# Altium project 16515-SBC_TO_MC2_PCA.PrjPcb (part 1 of 2)
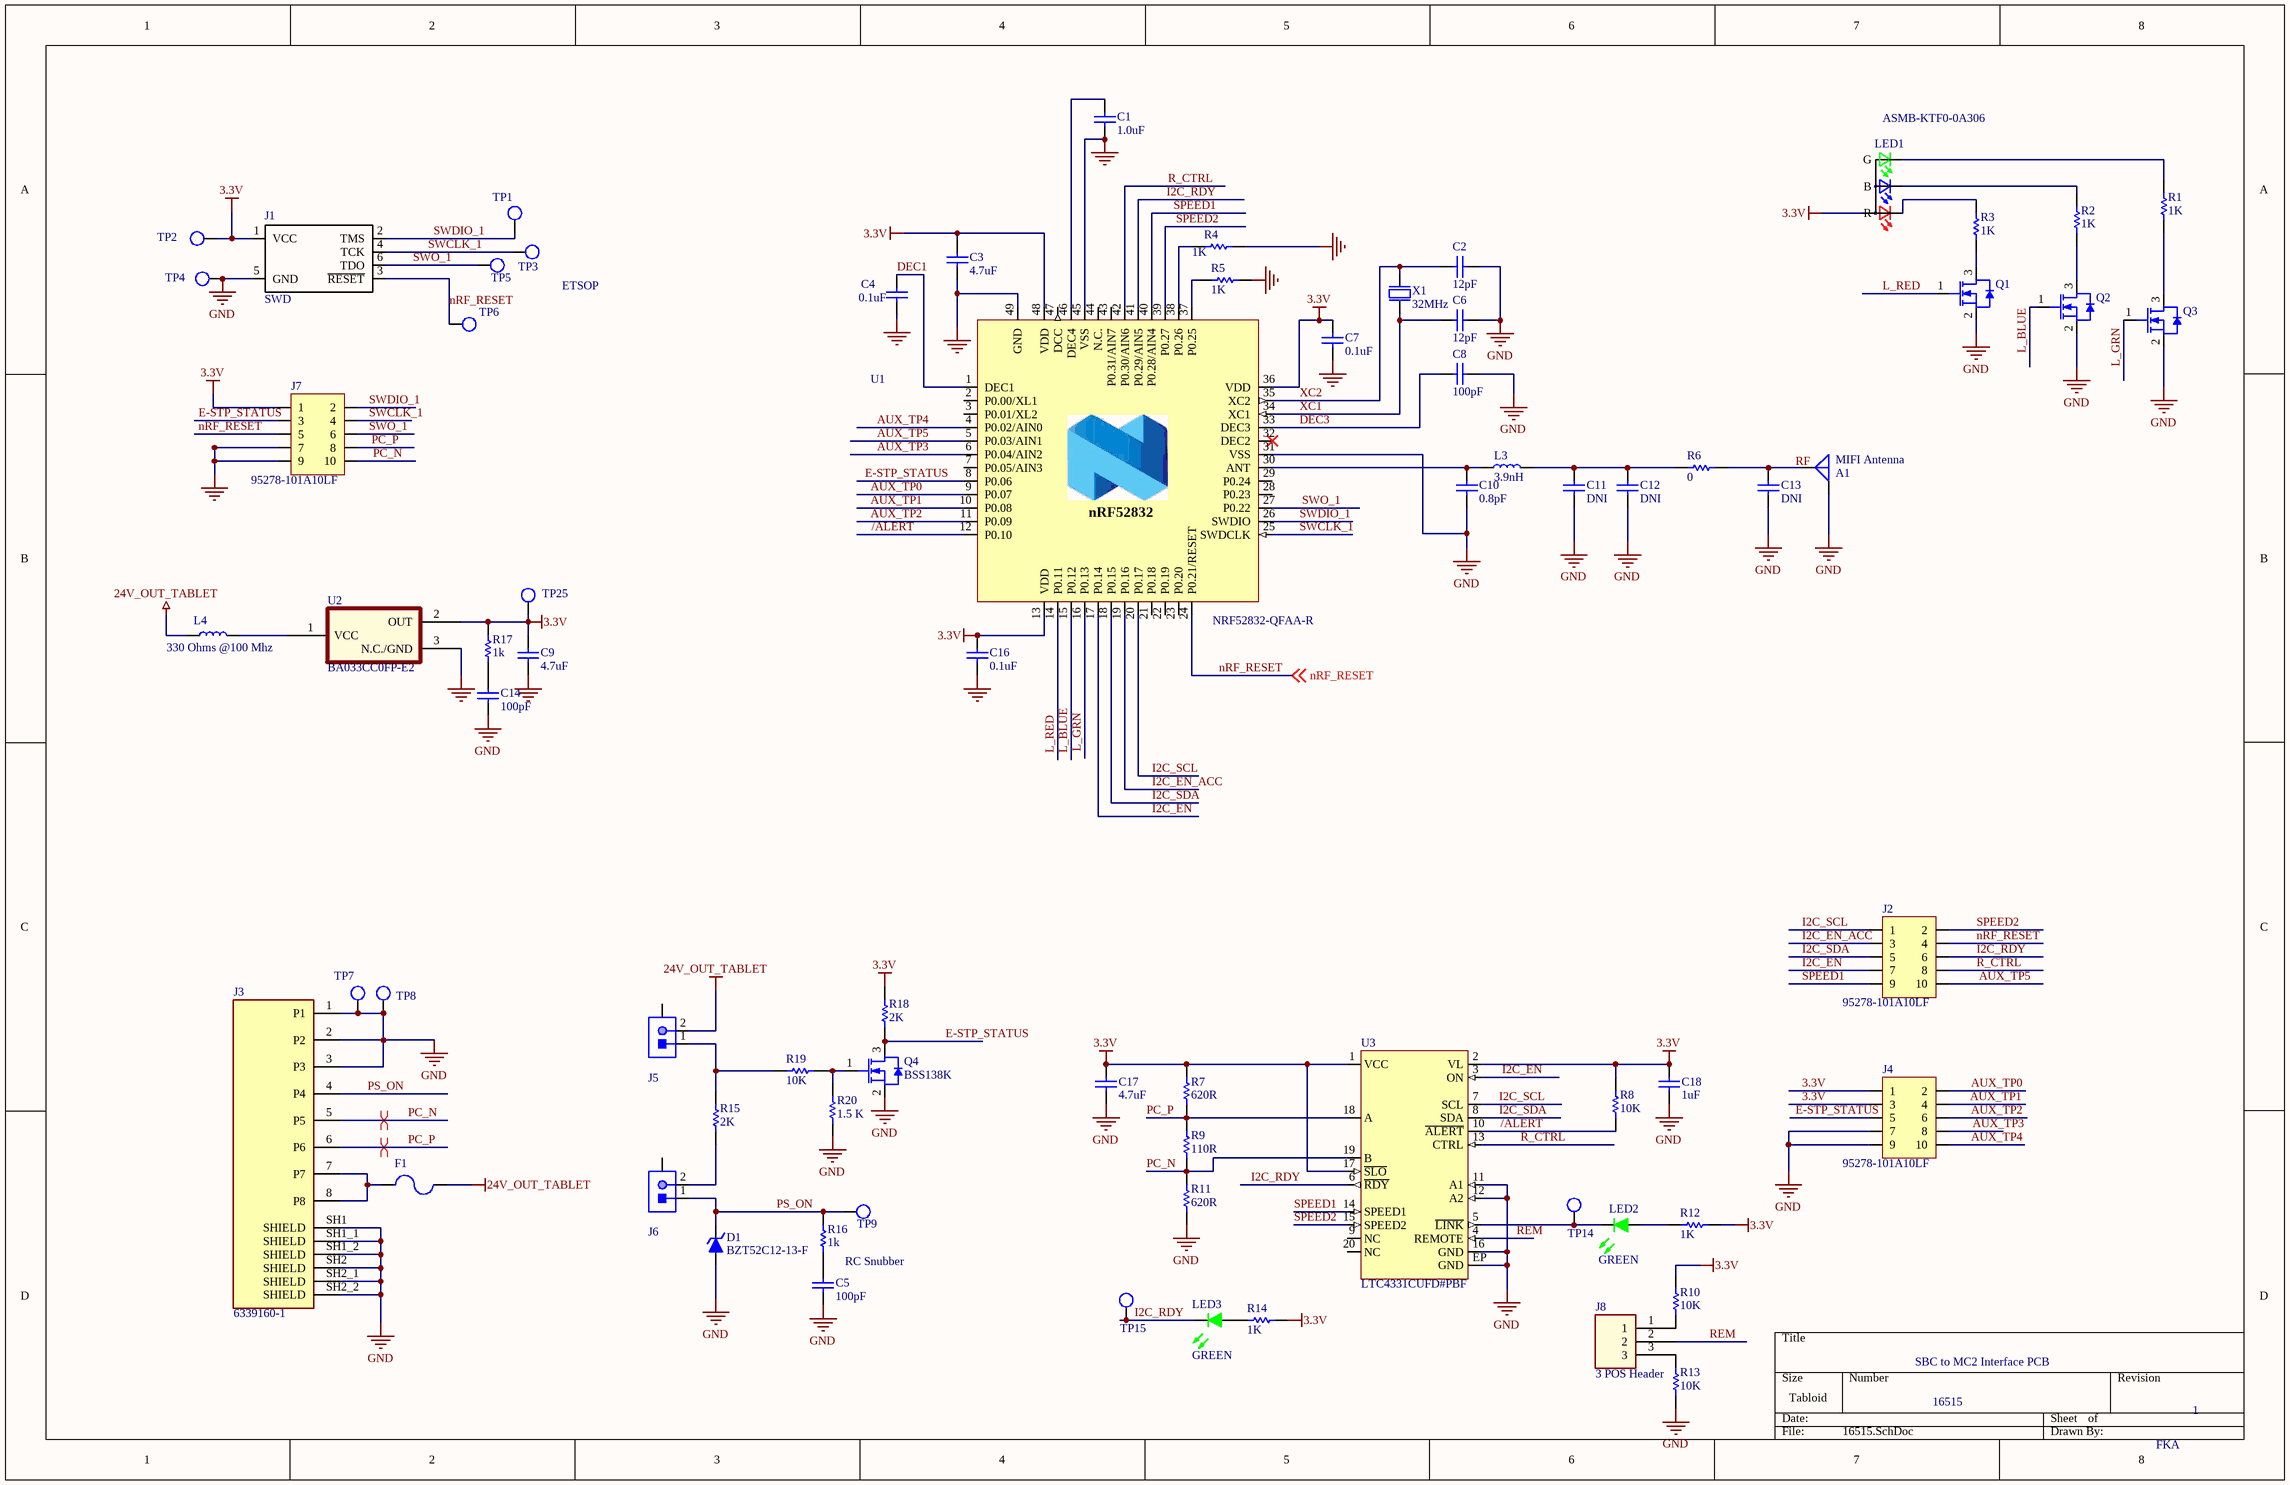
[diagram p0: 16515.SchDoc]
1 sheet, 73 parts. Net scope: global (net labels, ports and power ports of the same name join across sheets).
Board file: 16515.PcbDoc

## Sheet 16515.SchDoc: SBC to MC2 Interface PCB
size Tabloid; DrawnBy: FKA; DocumentNumber: 16515; Revision: 1; SheetNumber: 1; SheetTotal: 1

### Parts
A1  MIFI Antenna  [BLE Antenna]  (no BOM)
C1  1.0uF  [CAPC0603X10N]
C2  12pF  [CAPC0402X06N]
C3  4.7uF  [CAPC0603X10N]
C4  0.1uF  [CAPC0402X06N]
C5  100pF  [CAPC0603X10N]
C6  12pF  [CAPC0402X06N]
C7  0.1uF  [CAPC0402X06N]
C8  100pF  [CAPC0402X06N]
C9  4.7uF  [CAPC0603X10N]
C10  0.8pF  [CAPC0402X06N]
C11  DNI  [CAPC0402X06N]  (no BOM)
C12  DNI  [CAPC0402X06N]  (no BOM)
C13  DNI  [CAPC0402X06N]  (no BOM)
C14  100pF  [CAPC0603X10N]
C16  0.1uF  [CAPC0402X06N]
C17  4.7uF  [CAPC0402X06N]
C18  1uF  [CAPC0402X06N]
D1  BZT52C12-13-F  [SOD-123/Mini-SMA]
F1  Fuse  [FUSE2920]  (value not drawn)
J1  SWD  [TC2030-IDC-NL]  (no BOM)
J2  95278-101A10LF  [Amphenol_95278-101A10LF_0]
J3  6339160-1  [TE_6339160-1]
J4  95278-101A10LF  [Amphenol_95278-101A10LF_0]
J5  SM02B-PASS-TBT(LF)(SN)  [SM02B-PASS-TBT(LF)(SN)]  (value not drawn)
J6  SM02B-PASS-TBT(LF)(SN)  [SM02B-PASS-TBT(LF)(SN)]  (value not drawn)
J7  95278-101A10LF  [Amphenol_95278-101A10LF_0]
J8  3 POS Header  [3_POS_Header]
L3  3.9nH  [INDC0402X04N]
L4  330 Ohms @100 Mhz  [INDC0603X10N]
LED1  ASMB-KTF0-0A306  [ASMB-KTF0-0A306]
LED2  GREEN  [0603]
LED3  GREEN  [0603]
Q1  2SK3018T106  [SOT23]  (value not drawn)
Q2  2SK3018T106  [SOT23]  (value not drawn)
Q3  2SK3018T106  [SOT23]  (value not drawn)
Q4  BSS138K  [SOT-23-3]
R1  1K  [RESC0402X04N]
R2  1K  [RESC0402X04N]
R3  1K  [RESC0402X04N]
R4  1K  [RESC0402X04N]
R5  1K  [RESC0402X04N]
R6  0  [RESC0402X04N]
R7  620R  [RESC0402X04N]
R8  10K  [RESC0603X06N]
R9  110R  [RESC0402X04N]
R10  10K  [RESC0603X06N]
R11  620R  [RESC0402X04N]
R12  1K  [RESC0402X04N]
R13  10K  [RESC0603X06N]
R14  1K  [RESC0402X04N]
R15  2K  [RESC1206X09N]
R16  1k  [RESC0805X06N]
R17  1k  [RESC0805X06N]
R18  2K  [RESC1206X09N]
R19  10K  [RESC1206X09N]
R20  1.5 K  [RESC1206X09N]
TP1  (no value)  [Test Point]  (no BOM)
TP2  (no value)  [Test Point]  (no BOM)
TP3  (no value)  [Test Point]  (no BOM)
TP4  (no value)  [Test Point]  (no BOM)
TP5  (no value)  [Test Point]  (no BOM)
TP6  (no value)  [Test Point]  (no BOM)
TP7  (no value)  [Test Point]  (no BOM)
TP8  (no value)  [Test Point]  (no BOM)
TP9  (no value)  [Test Point]  (no BOM)
TP14  (no value)  [Test Point]  (no BOM)
TP15  (no value)  [Test Point]  (no BOM)
TP25  (no value)  [Test Point]  (no BOM)
U1  NRF52832-QFAA-R  [QFN40P600X600X90-48N]
U2  BA033CC0FP-E2  [TO252-3_BA033CC0FP-E2]
U3  LTC4331CUFD#PBF  [20-WFQFN]
X1  32MHz  [BT-XTAL_2016]

### Nets
3.3V: C3.1 C7.1 C9.2 C16.1 C17.2 C18.2 J1.1(VCC) J4.1 J4.3 J7.1 LED1.1(A) R7.2 R8.2 R10.1 R12.1 R14.1 R17.2 R18.1 TP2.1 TP25.1 U1.13(VDD) U1.36(VDD) U1.48(VDD) U2.2(OUT) U3.1(VCC) U3.2(VL) U3.17(~{SLO})
24V_OUT_TABLET: F1.2 J5.2 L4.1
GND: A1.GND(G) C1.1 C2.2 C3.2 C4.2 C5.2 C6.2 C7.2 C8.2 C9.1 C10.1 C11.2 C12.2 C13.2 C14.2 C16.2 C17.1 C18.1 D1.1(A) J1.5(GND) J3.1(P1) J3.2(P2) J3.3(P3) J3.SH1(SHIELD) J3.SH1_1(SHIELD) J3.SH1_2(SHIELD) J3.SH2(SHIELD) J3.SH2_1(SHIELD) J3.SH2_2(SHIELD) J4.7 J4.9 J7.7 J7.9 Q1.2(S) Q2.2(S) Q3.2(S) Q4.2(S) R4.2 R5.2 R11.1 R13.1 R20.2 TP4.1 TP7.1 TP8.1 U1.31(VSS) U1.45(VSS) U1.49(GND) U2.3(N.C./GND) U3.11(A1) U3.12(A2) U3.16(GND) U3.EP(GND) X1.2(GND) X1.4(GND)
/ALERT: R8.1 U1.12(P0.10) U3.10(~{ALERT})
AUX_TP0: J4.2 U1.9(P0.07)
AUX_TP1: J4.4 U1.10(P0.08)
AUX_TP2: J4.6 U1.11(P0.09)
AUX_TP3: J4.8 U1.6(P0.04/AIN2)
AUX_TP4: J4.10 U1.4(P0.02/AIN0)
AUX_TP5: J2.10 U1.5(P0.03/AIN1)
DEC1: C4.1 U1.1(DEC1)
DEC3: C8.1 U1.33(DEC3)
E-STP_STATUS: J4.5 J7.3 Q4.3(D) R18.2 U1.8(P0.06)
I2C_EN: J2.7 U1.17(P0.14) U3.3(ON)
I2C_EN_ACC: J2.3 U1.19(P0.16)
I2C_RDY: J2.6 LED3.2(K) TP15.1 U1.41(P0.29/AIN5) U3.6(~{RDY})
I2C_SCL: J2.1 U1.20(P0.17) U3.7(SCL)
I2C_SDA: J2.5 U1.18(P0.15) U3.8(SDA)
L_BLUE: Q2.1(G) U1.15(P0.12)
L_GRN: Q3.1(G) U1.16(P0.13)
L_RED: Q1.1(G) U1.14(P0.11)
nRF_RESET: J1.3(~{RESET}) J2.4 J7.5 TP6.1 U1.24(P0.21/RESET) ; off-sheet nRF_RESET
PC_N: J3.5(P5) J7.10 R9.1 R11.2 U3.19(B)
PC_P: J3.6(P6) J7.8 R7.1 R9.2 U3.18(A)
PS_ON: D1.2(K) J3.4(P4) J6.1 R16.2 TP9.1
R_CTRL: J2.8 U1.42(P0.30/AIN6) U3.13(CTRL)
REM: J8.2 U3.4(REMOTE)
SPEED1: J2.9 U1.40(P0.28/AIN4) U3.14(SPEED1)
SPEED2: J2.2 U1.39(P0.27) U3.15(SPEED2)
SWCLK_1: J1.4(TCK) J7.4 TP3.1 U1.25(SWDCLK)
SWDIO_1: J1.2(TMS) J7.2 TP1.1 U1.26(SWDIO)
SWO_1: J1.6(TDO) J7.6 TP5.1 U1.27(P0.22)
XC1: C6.1 U1.34(XC1) X1.1(inp)
XC2: C2.1 U1.35(XC2) X1.3(out)
NetA1_ANT: A1.ANT(S) C13.1 R6.2
NetC1_2: C1.2 U1.46(DEC4)
NetC5_1: C5.1 R16.1
NetC10_2: C10.2 L3.1 U1.30(ANT)
NetC11_1: C11.1 C12.1 L3.2 R6.1
NetC14_1: C14.1 R17.1
NetF1_1: F1.1 J3.7(P7) J3.8(P8)
NetJ5_1: J5.1 R15.2 R19.2
NetJ6_2: J6.2 R15.1
NetJ8_1: J8.1 R10.2
NetJ8_3: J8.3 R13.2
NetL4_2: L4.2 U2.1(VCC)
NetLED1_2: LED1.2(R) R3.2
NetLED1_3: LED1.3(G) R1.2
NetLED1_4: LED1.4(B) R2.2
NetLED2_1: LED2.1(A) R12.2
NetLED2_2: LED2.2(K) TP14.1 U3.5(~{LINK})
NetLED3_1: LED3.1(A) R14.2
NetQ1_3: Q1.3(D) R3.1
NetQ2_3: Q2.3(D) R2.1
NetQ3_3: Q3.3(D) R1.1
NetQ4_1: Q4.1(G) R19.1 R20.1
NetR4_1: R4.1 U1.38(P0.26)
NetR5_1: R5.1 U1.37(P0.25)

Not connected (* = marked no-connect by the designer): J5 3(MF); J6 3(MF); U1 2(P0.00/XL1) 3(P0.01/XL2) 7(P0.05/AIN3) 21(P0.18) 22(P0.19) 23(P0.20) 28(P0.23) 29(P0.24) 32(DEC2)* 43(P0.31/AIN7) 44(N.C.) 47(DCC); U3 9(NC) 20(NC)

### Layout directives
differential pair: PC_N, PC_P

### Notes on the sheet
- ETSOP
- RC Snubber
- Labels drawn without touching a wire or pin: RF
- (in symbol NRF52832-QFAA-R) nRF52832